# EAGLE design Soldier Tracking (EAGLE 6.1)
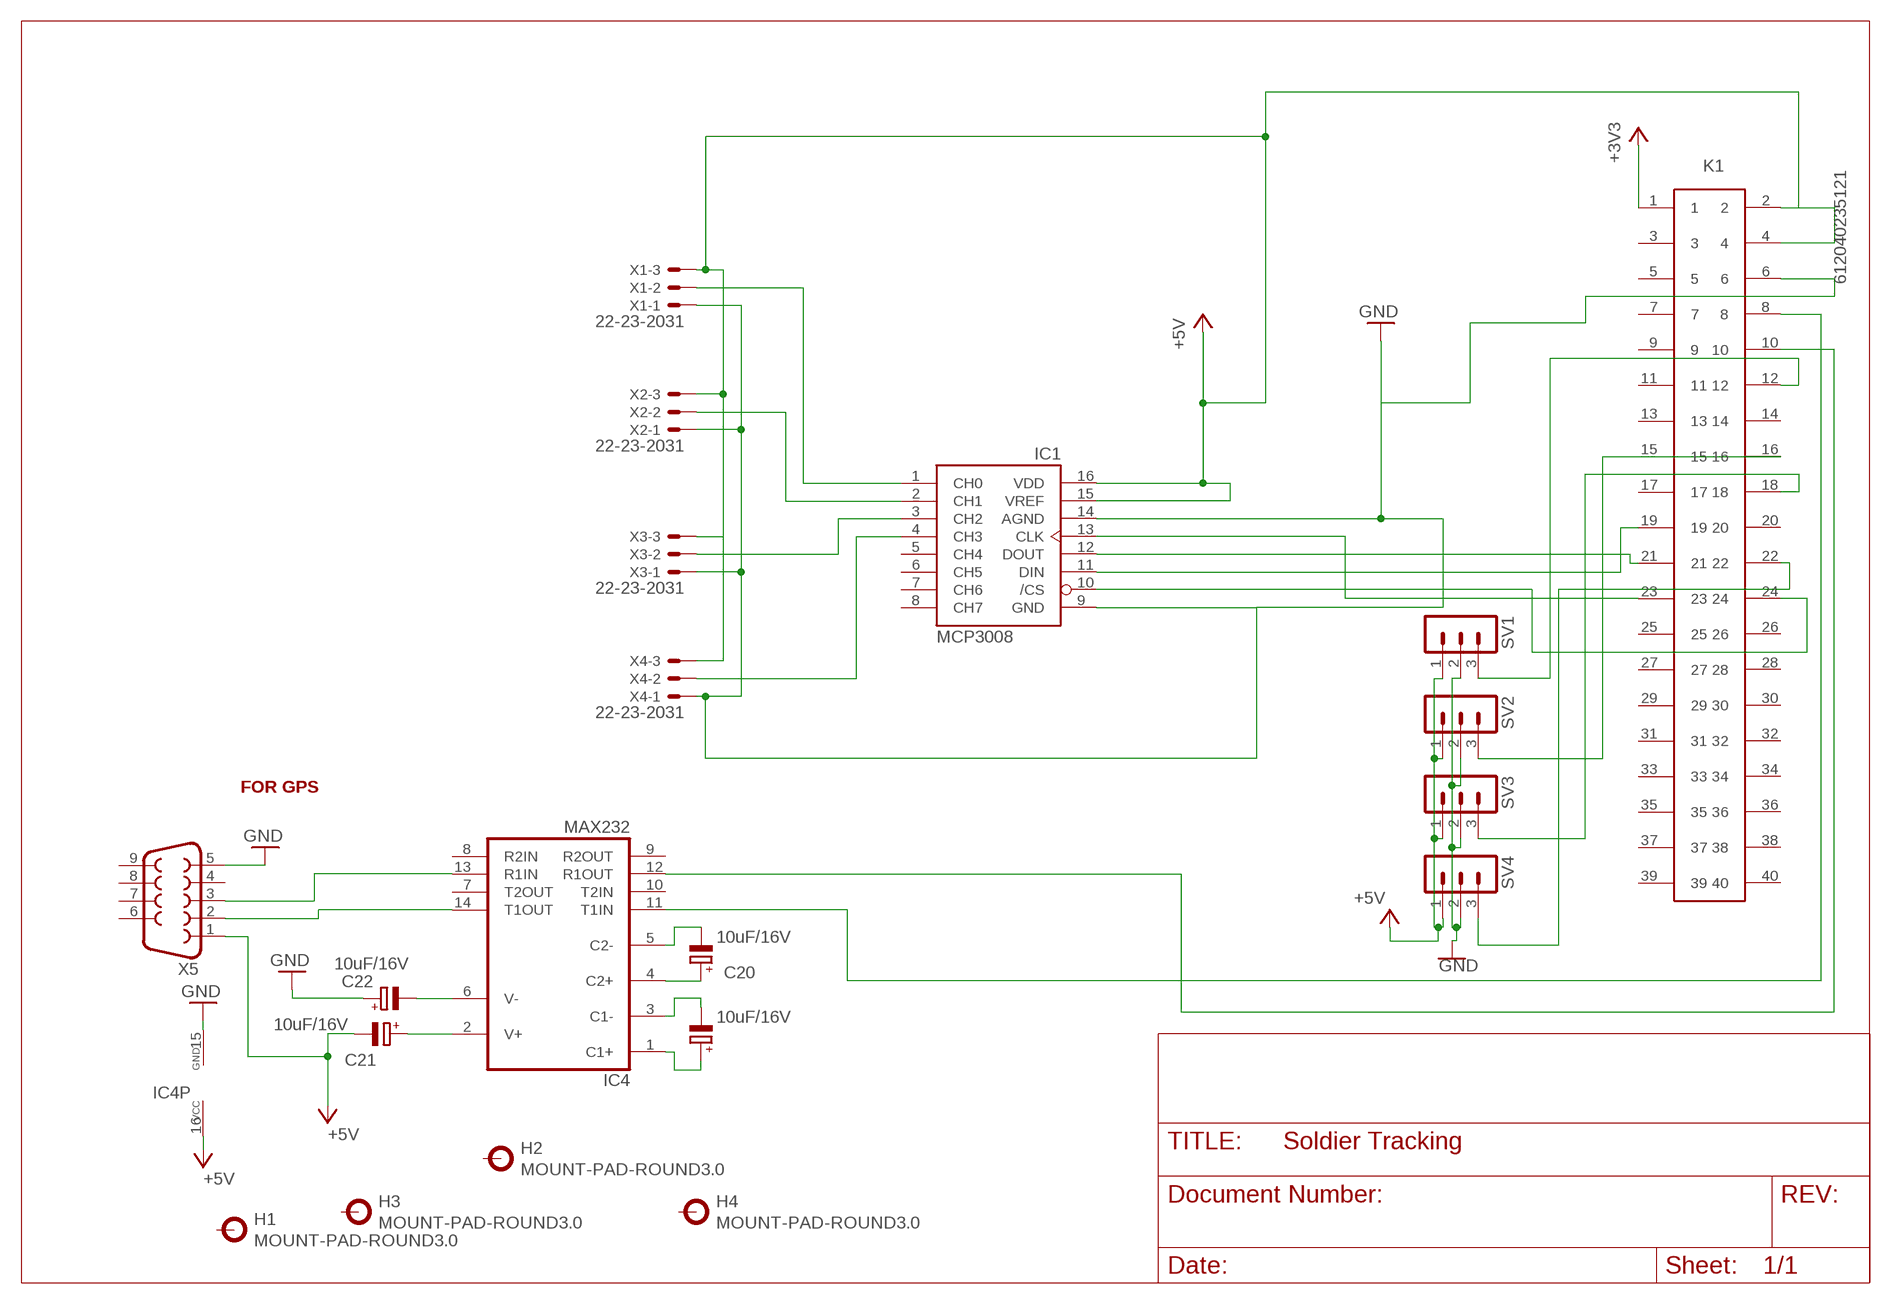
[diagram p0: schematic, sheet 1]

## Parts
C17  10uF/16V  CPOL-EUE2.5-6  [E2,5-6]
C20  10uF/16V  CPOL-EUE2.5-6  [E2,5-6]
C21  10uF/16V  CPOL-EUE2.5-6  [E2,5-6]
C22  10uF/16V  CPOL-EUE2.5-6  [E2,5-6]
H1  MOUNT-PAD-ROUND3.0  [3,0-PAD]
H2  MOUNT-PAD-ROUND3.0  [3,0-PAD]
H3  MOUNT-PAD-ROUND3.0  [3,0-PAD]
H4  MOUNT-PAD-ROUND3.0  [3,0-PAD]
IC1  MCP3008  [DIL16]
IC4  MAX232  [DIL16]
K1  612040235121  [612040235121]
SV1  MA03-1  [MA03-1]
SV2  MA03-1  [MA03-1]
SV3  MA03-1  [MA03-1]
SV4  MA03-1  [MA03-1]
X1  22-23-2031  [22-23-2031]
X2  22-23-2031  [22-23-2031]
X3  22-23-2031  [22-23-2031]
X4  22-23-2031  [22-23-2031]
X5  F09HP  [F09HP]

## Nets
+3V3: K1.1
+5V: C21.- IC1.15(VREF) IC1.16(VDD) IC4.16(VCC) K1.2 K1.4 SV1.1 SV2.1 SV3.1 SV4.1 X1.3 X2.3 X3.3 X4.3 X5.1
GND: C22.+ IC1.9(GND) IC1.14(AGND) IC4.15(GND) K1.6 SV1.2 SV2.2 SV3.2 SV4.2 X1.1 X2.1 X3.1 X4.1 X5.5
N$1: IC1.1(CH0) X1.2
N$2: IC1.2(CH1) X2.2
N$3: IC1.3(CH2) X3.2
N$4: IC1.4(CH3) X4.2
N$5: K1.12 SV1.3
N$6: K1.16 SV2.3
N$7: K1.18 SV3.3
N$8: K1.22 SV4.3
N$9: IC1.10(/CS) K1.24
N$10: IC1.11(DIN) K1.19
N$11: IC1.12(DOUT) K1.21
N$12: IC1.13(CLK) K1.23
N$14: IC4.11(T1IN) K1.8
N$15: IC4.12(R1OUT) K1.10
N$24: C17.+ IC4.1(C1+)
N$25: C17.- IC4.3(C1-)
N$28: C20.+ IC4.4(C2+)
N$29: C20.- IC4.5(C2-)
N$30: C21.+ IC4.2(V+)
N$32: C22.- IC4.6(V-)
N$33: IC4.14(T1OUT) X5.2
N$34: IC4.13(R1IN) X5.3
Unconnected: H1.B3,0(MOUNT) H2.B3,0(MOUNT) H3.B3,0(MOUNT) H4.B3,0(MOUNT) IC1.5(CH4) IC1.6(CH5) IC1.7(CH6) IC1.8(CH7) IC4.7(T2OUT) IC4.8(R2IN) IC4.9(R2OUT) IC4.10(T2IN) K1.3 K1.5 K1.7 K1.9 K1.11 K1.13 K1.14 K1.15 K1.17 K1.20 K1.25 K1.26 K1.27 K1.28 K1.29 K1.30 K1.31 K1.32 K1.33 K1.34 K1.35 K1.36 K1.37 K1.38 K1.39 K1.40 X5.4 X5.6 X5.7 X5.8 X5.9

## Notes on the sheet
- FOR GPS

## Library data of the parts
C17 C20-C22 = resistor:CPOL-EU: POLARIZED CAPACITOR, European symbol
H1-H4 = holes3.0:MOUNT-PAD-ROUND: MOUNTING PAD, round
IC1 = adafruit:MCP3008
IC4 = maxim:MAX232: RS232 TRANSEIVER
K1 = Wire_to_Board_Connectors_rev15d:612040235121: WR-BHD 2.54mm Male Box Header High Temperature, 40 Pins=>Code : Con_WTB_BHD_2.54_Male_THT_RS_612040235121 <http://katalog.we-online.de/media/thumbs2/eican/thb_Con_WTB_BHD_2.54_Male_THT_RS_6120xx235121_pf2.jpg> Details see: http://katalog.we-online.de/en/em/612_0xx_235_121 Created 2014-06-05, Karrer Zheng 2014 (C) Würth Elektronik
SV1-SV4 = con-lstb:MA03-1: PIN HEADER; OC_FARNELL: unknown; OC_NEWARK: unknown
X1-X4 = con-molex:22-23-2031: .100" (2.54mm) Center Header - 3 Pin; MF: MOLEX; MPN: 22-23-2031; OC_FARNELL: 1462950; OC_NEWARK: 30C0862
X5 = con-subd:F09: SUB-D

## Board
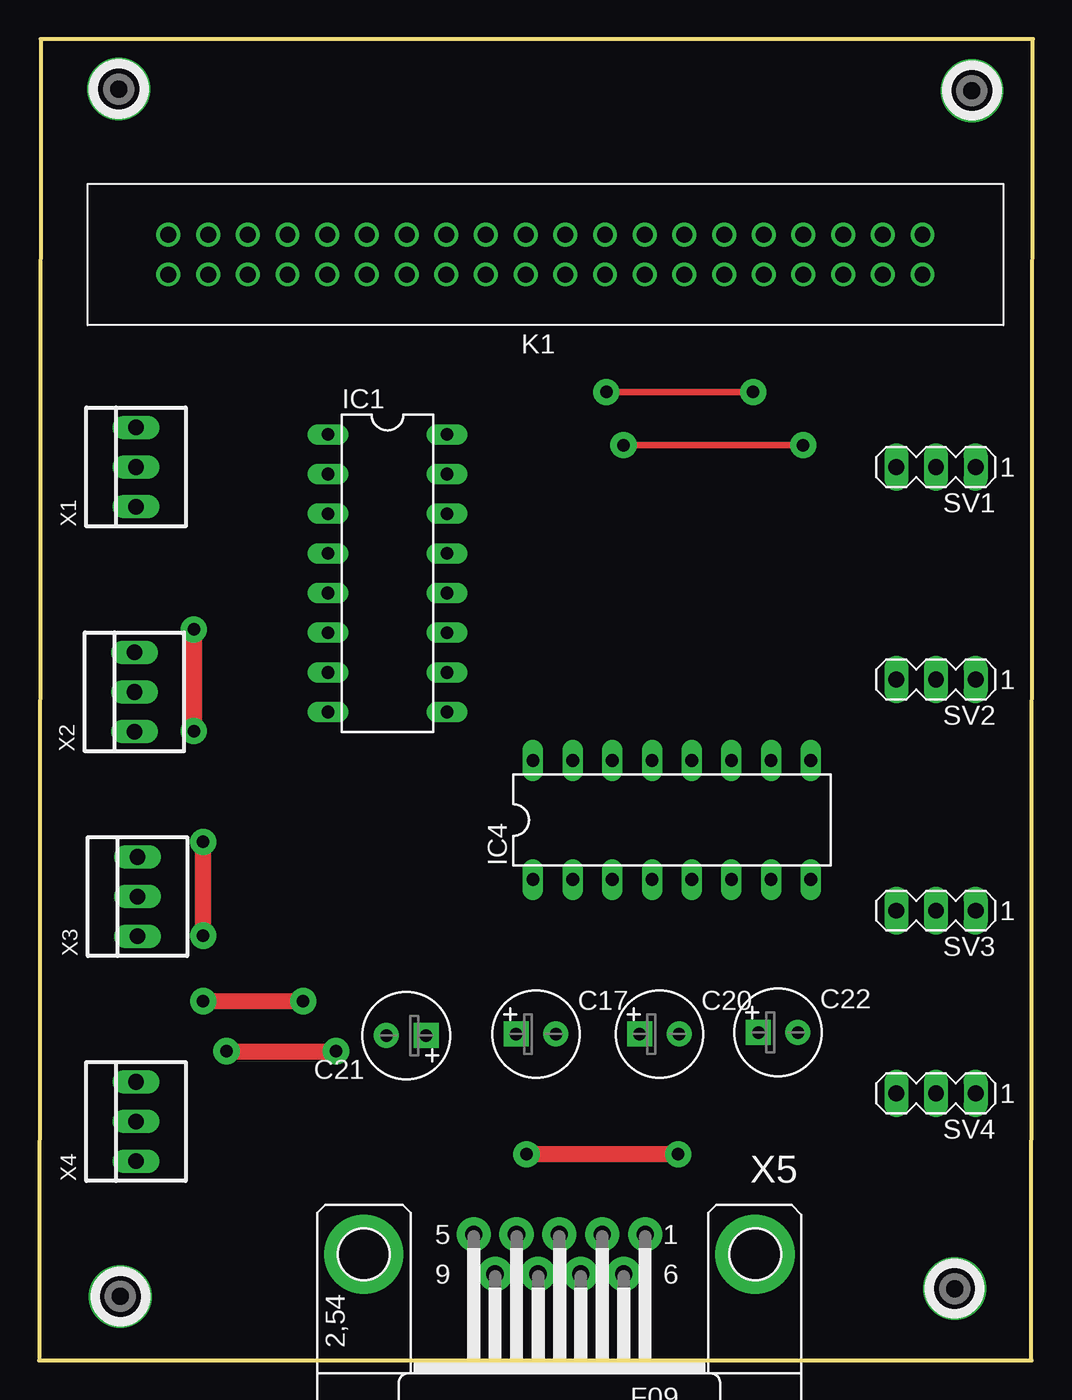
[diagram p1: board, top side]
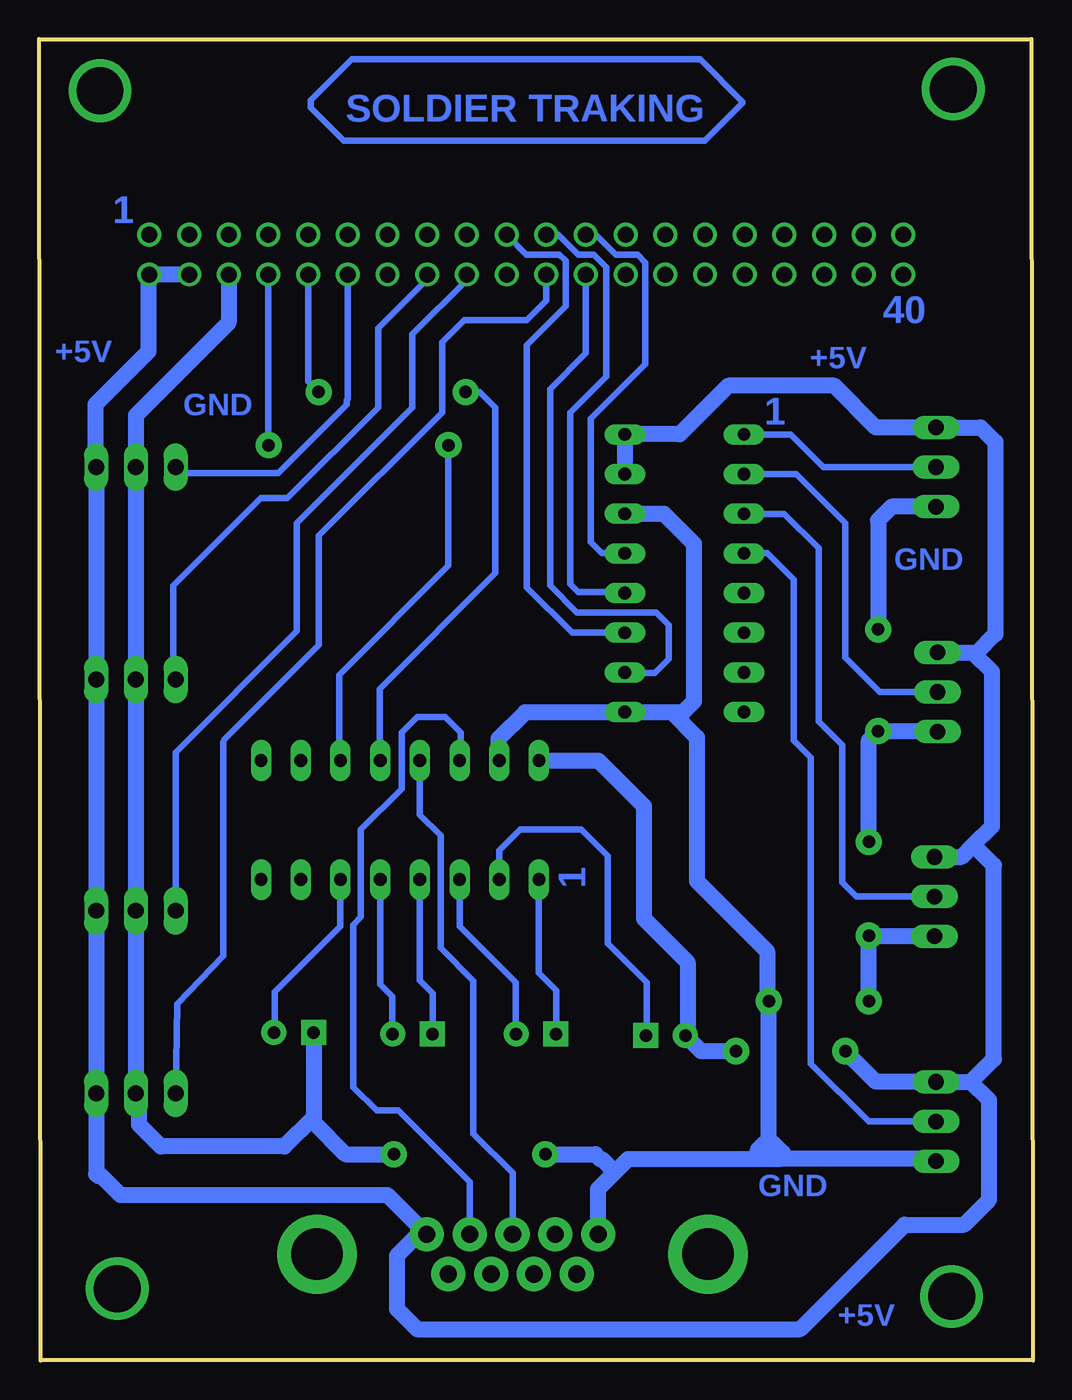
[diagram p2: board, bottom side, seen from below]

Size 63.6 x 84.6 mm. Coordinates in mm from the lower left corner, seen from the top.
Outline: 0,0 63.5,0 63.6,84.6 0.1,84.6 0,0
Copper layers (1*16): Top 0.035mm / dielectric 1.5mm / Bottom 0.035mm
Design rules: minimum track width 10mil, minimum drill 24mil, track to track 8mil, track to pad 8mil, pad to pad 8mil, via to via 8mil, smd to smd 8mil, copper to edge 40mil, drill to drill 8mil, minimum pad ring 10mil, minimum via ring 8mil, stop-mask expansion 4mil, vias tented up to drill 0mil, thermal gap 10mil

### Footprints (pad centres in the part's own frame; a part is rotated, then mirrored left to right if it is on the bottom)
E2,5-6 = drill 0.8 pad 1.6 square: + -1.27,0 | drill 0.8 pad 1.6: - 1.27,0
3,0-PAD = drill 3 pad 0.813: B3,0 0,0
DIL16 = drill 0.813 long: 1 -8.89,-3.81; 2 -6.35,-3.81; 3 -3.81,-3.81; 4 -1.27,-3.81; 5 1.27,-3.81; 6 3.81,-3.81; 7 6.35,-3.81; 8 8.89,-3.81; 9 8.89,3.81; 10 6.35,3.81; 11 3.81,3.81; 12 1.27,3.81; 13 -1.27,3.81; 14 -3.81,3.81; 15 -6.35,3.81; 16 -8.89,3.81
612040235121 = drill 1.02: 1 -2.54,-1.27; 2 -2.54,1.27; 3 0,-1.27; 4 0,1.27; 5 2.54,-1.27; 6 2.54,1.27; 7 5.08,-1.27; 8 5.08,1.27; 9 7.62,-1.27; 10 7.62,1.27; 11 10.16,-1.27; 12 10.16,1.27; 13 12.7,-1.27; 14 12.7,1.27; 15 15.24,-1.27; 16 15.24,1.27; 17 17.78,-1.27; 18 17.78,1.27; 19 20.32,-1.27; 20 20.32,1.27; 21 22.86,-1.27; 22 22.86,1.27; 23 25.4,-1.27; 24 25.4,1.27; 25 27.94,-1.27; 26 27.94,1.27; 27 30.48,-1.27; 28 30.48,1.27; 29 33.02,-1.27; 30 33.02,1.27; 31 35.56,-1.27; 32 35.56,1.27; 33 38.1,-1.27; 34 38.1,1.27; 35 40.64,-1.27; 36 40.64,1.27; 37 43.18,-1.27; 38 43.18,1.27; 39 45.72,-1.27; 40 45.72,1.27
MA03-1 = drill 1.016 long: 1 -2.54,0; 2 0,0; 3 2.54,0
22-23-2031 = drill 1 long: 1 -2.54,0; 2 0,0; 3 2.54,0
F09HP = drill 1.1 pad 2.184: 1 -5.486,-1.27; 2 -2.743,-1.27; 3 0,-1.27; 4 2.743,-1.27; 5 5.486,-1.27; 6 -4.115,1.27; 7 -1.372,1.27; 8 1.372,1.27; 9 4.115,1.27 | drill 3.302 pad 5.08: G1 -12.522,0; G2 12.522,0

### Placement (x,y rotation side)
C17  31.8,20.9 0 top
C20  39.7,20.9 0 top
C21  23.5,20.8 180 top
C22  47.3,21 0 top
H1  5.2,4.1 0 top
H2  58.6,4.6 0 top
H3  5.1,81.4 0 top
H4  59.7,81.3 0 top
IC1  22.3,50.4 270 top
IC4  40.5,34.6 0 top
K1  54,70.8 180 top
SV1  57.4,57.2 180 top
SV2  57.4,43.6 180 top
SV3  57.4,28.8 180 top
SV4  57.4,17.1 180 top
X1  6.2,57.2 90 top
X2  6.1,42.8 90 top
X3  6.3,29.7 90 top
X4  6.2,15.3 90 top
X5  33.3,6.8 180 top

### Tracks (layer width: path | path; a pad name or v marks a point on that pad's centre or on a via)
+5V  (via drill 0.8 pad 1.68)
  Top 1.016: v12,19.8 v19,19.8
  Bottom 1.016: 3.8,45.3 3.6,45.3 2.4,46.5 2.4,58.8 3.34,59.74 X1.3 10.04,59.74 12.7,62.4 19.5,62.4 22.6,59.3 IC1.16 26.11,56.81 26.1,56.8 26.11,56.79 IC1.15 | 3.8,45.3 6.06,45.3 X2.3 | X3.3 4.56,32.24 3.8,33 | 3.8,33 2.6,34.2 2.6,44.1 3.8,45.3 | 3.96,17.84 X4.3 10.04,17.84 v12,19.8 | 3.96,17.84 2.5,19.3 2.5,31.7 3.8,33 | K1.4 56.47,69.53 56.6,69.4 | 56.6,69.4 56.6,69.47 K1.2 | 56.6,69.4 56.6,64.6 60,61.2 60,57.26 SV1.1 SV2.1 SV3.1 SV4.1 59.94,11.94 59.8,11.8 59.6,11.8 58.4,10.6 41.32,10.6 X5.1 39.33,8.07 40.7,6.7 40.7,3.3 39.4,2 14.9,2 8.2,8.7 4.4,8.7 2.8,10.3 2.8,16.68 3.96,17.84 | v19,19.8 21.23,19.8 C21.- 22.1,20.93 22.1,25.5 24.9,28.3 24.9,35.5 27.81,38.41 IC4.16
GND  (via drill 0.8 pad 1.68)
  Top 1.016: v9.9,46.8 v9.9,40.3 | v10.5,27.2 v10.5,33.2 | v16.9,23 v10.5,23 | v40.9,13.2 v31.2,13.2
  Bottom 1.016: IC1.14 23.61,54.21 21.7,52.3 21.7,42.2 22.4,41.5 IC1.9 | IC1.9 23.11,41.51 21.5,39.9 21.5,30.7 17,26.2 17,23.2 16.9,23.1 v16.9,23 16.9,13.6 | X5.5 27.81,10.99 26.75,12.05 | 26.75,12.05 25.9,12.9 16.2,12.9 | X4.1 6.34,12.9 16.2,12.9 | X1.1 9.04,54.66 9.9,53.8 v9.9,46.8 | X2.1 6.14,40.3 v9.9,40.3 10.5,39.7 v10.5,33.2 | X3.1 10.46,27.16 v10.5,27.2 v10.5,23 | K1.6 51.46,66.44 57.4,60.5 SV1.2 SV2.2 SV3.2 SV4.2 57.2,16.9 57.2,15.1 55.8,13.7 47.9,13.7 46.03,15.57 | C22.+ 46.03,15.57 | 16.2,12.9 16.9,13.6 | 46.03,15.57 46.03,15.23 44,13.2 v40.9,13.2 | v31.2,13.2 28,13.2 27.7,12.9 27.6,12.9 26.75,12.05 | IC1.9 32.5,41.5 34.2,39.8 34.2,38.46 IC4.15 | 17.3,13.8 17.3,13.6 | 17.3,13.6 17.6,13.3 17.6,13.5 17.2,13.9 16.6,13.9 16,13.3 | 16.9,13.6 17.3,13.6
N$1
  Bottom 0.406: IC1.1 15.49,59.29 13.4,57.2 X1.2
N$2
  Bottom 0.406: IC1.2 15.15,56.75 12,53.6 12,45 9.8,42.8 X2.2
N$3
  Bottom 0.406: X3.2 11.3,29.7 12.2,30.6 12.2,39.4 13.7,40.9 13.7,52 15.9,54.2 IC1.3
N$4
  Bottom 0.406: X4.2 10.5,15.3 14.2,19 14.2,38.6 15.3,39.7 15.3,50 17,51.7 18.46,51.7 IC1.4
N$5
  Bottom 0.406: K1.12 43.84,61.56 43.9,61.5 43.9,61.2 48.3,56.8 54.46,56.8 SV1.3
N$6
  Bottom 0.406: K1.16 38.76,69.24 41.9,66.1 41.9,61 47.7,55.2 49.4,55.2 55,49.6 55,43.7 54.9,43.6 SV2.3
N$7
  Bottom 0.406: SV3.3 54.86,38.94 47.1,46.7 47.1,53.6 39.7,61 39.7,65.7 36.22,69.18 K1.18
N$8
  Bottom 0.406: SV4.3 54.76,22.84 51.8,25.9 51.8,39.6 51.7,39.8 45.7,45.8 45.7,52.8 37.8,60.7 37.8,65.2 36.4,66.6 32.4,66.6 31.14,67.86 K1.22
N$9
  Bottom 0.406: K1.24 28.6,64.5 30.9,62.2 30.9,49.6 29.2,47.9 24.1,47.9 23.3,47.1 23.3,44.9 24.2,44 26.06,44 IC1.10
N$10
  Bottom 0.406: IC1.11 29.49,46.59 32.4,49.5 32.4,65 29.9,67.5 29.9,70.4 30.3,70.8 32.41,70.8 K1.19
N$11
  Bottom 0.406: K1.21 30.37,72.07 29.1,70.8 28.1,70.8 27.3,70 27.3,63 29.6,60.7 29.6,49.7 29.1,49.2 26.2,49.2 26.1,49.1
  Bottom 1.016: 26.1,49.1 IC1.12
N$12
  Bottom 0.406: K1.23 27.97,72.07 26.7,70.8 25.3,70.8 24.8,70.3 24.8,63.8 28.3,60.3 28.3,52.4 27.6,51.7 26.14,51.7 IC1.13
N$13
  Bottom 0.406: 21.3,83.3 43.6,83.3 46.2,80.7 46.2,80.2 44.1,78.1 21,78.1 18.6,80.5 18.6,80.6 21.3,83.3
N$14  (via drill 0.8 pad 1.68)
  Top 0.406: v48.9,58.6 v37.4,58.6
  Bottom 0.406: K1.8 48.92,59.32 48.9,59.3 v48.9,58.6 | v37.4,58.6 37.4,50.9 44.4,43.9 44.4,38.5 IC4.11
N$15  (via drill 0.8 pad 1.68)
  Top 0.406: v45.7,62 v36.3,62
  Bottom 0.406: K1.10 46.38,62.68 v45.7,62 | v36.3,62 35.4,62 34.4,61 34.4,50.4 41.8,43 41.8,38.4 | 41.8,38.4 41.8,38.3 | IC4.12 41.79,38.41 41.8,38.4
N$24
  Bottom 0.406: IC4.1 31.61,24.81 30.5,23.7 30.5,20.93 C17.+
N$25
  Bottom 0.406: IC4.3 36.69,27.79 33.1,24.2 33.1,20.93 C17.-
N$28
  Bottom 0.406: IC4.4 39.23,24.33 38.4,23.5 38.4,20.93 C20.+
N$29
  Bottom 0.406: IC4.5 41.77,24.07 41,23.3 41,20.93 C20.-
N$30
  Bottom 0.406: IC4.2 34.15,32.65 32.8,34 28.9,34 27.2,32.3 27.2,26.7 24.7,24.2 24.7,20.9 24.9,20.7 24.7,20.7 24.7,20.73 | 24.7,20.8 24.7,20.73 | 24.7,20.73 C21.+
N$32
  Bottom 0.406: IC4.6 44.31,27.79 48.5,23.6 48.5,21.07 C22.-
N$33
  Bottom 0.406: X5.2 36.04,11.44 40.6,16 42,16 43.5,17.5 43.5,27.9 43,28.4 43,34 40.4,36.6 40.4,40.2 39.4,41.2 37.6,41.2 36.6,40.2 36.6,38.5 IC4.14
N$34
  Bottom 0.406: IC4.13 39.23,34.93 37.9,33.6 37.9,26.4 35.8,24.3 35.8,14.5 33.3,12 X5.3 | X5.3 33.3,8 33.2,7.9 33.3,7.9 33.4,8 | 33.4,8 33.4,7.9 33.5,7.8 | X5.3 33.33,8.07 33.4,8

### Text on the board
Bottom: SOLDIER TRAKING | 1 | 40 | +5V | +5V | GND | 1 | GND | 1 | GND | +5V
_tNames: K1 | K1 | SV1 | SV1 | IC1 | IC1 | SV2 | SV2 | SV4 | SV4 | X3 | X3 | X4 | X4 | X1 | X1 | X2 | X2 | SV3 | SV3